# Altium schematic sheet DRS_POWER_GRAPH.SchDoc: My title
size A3; Organization: University of California; Address1: 475 Portola Plaza; Address2: Los Angeles, CA 90095; DocumentNumber: 3; Revision: R01; SheetNumber: 3; SheetTotal: 35
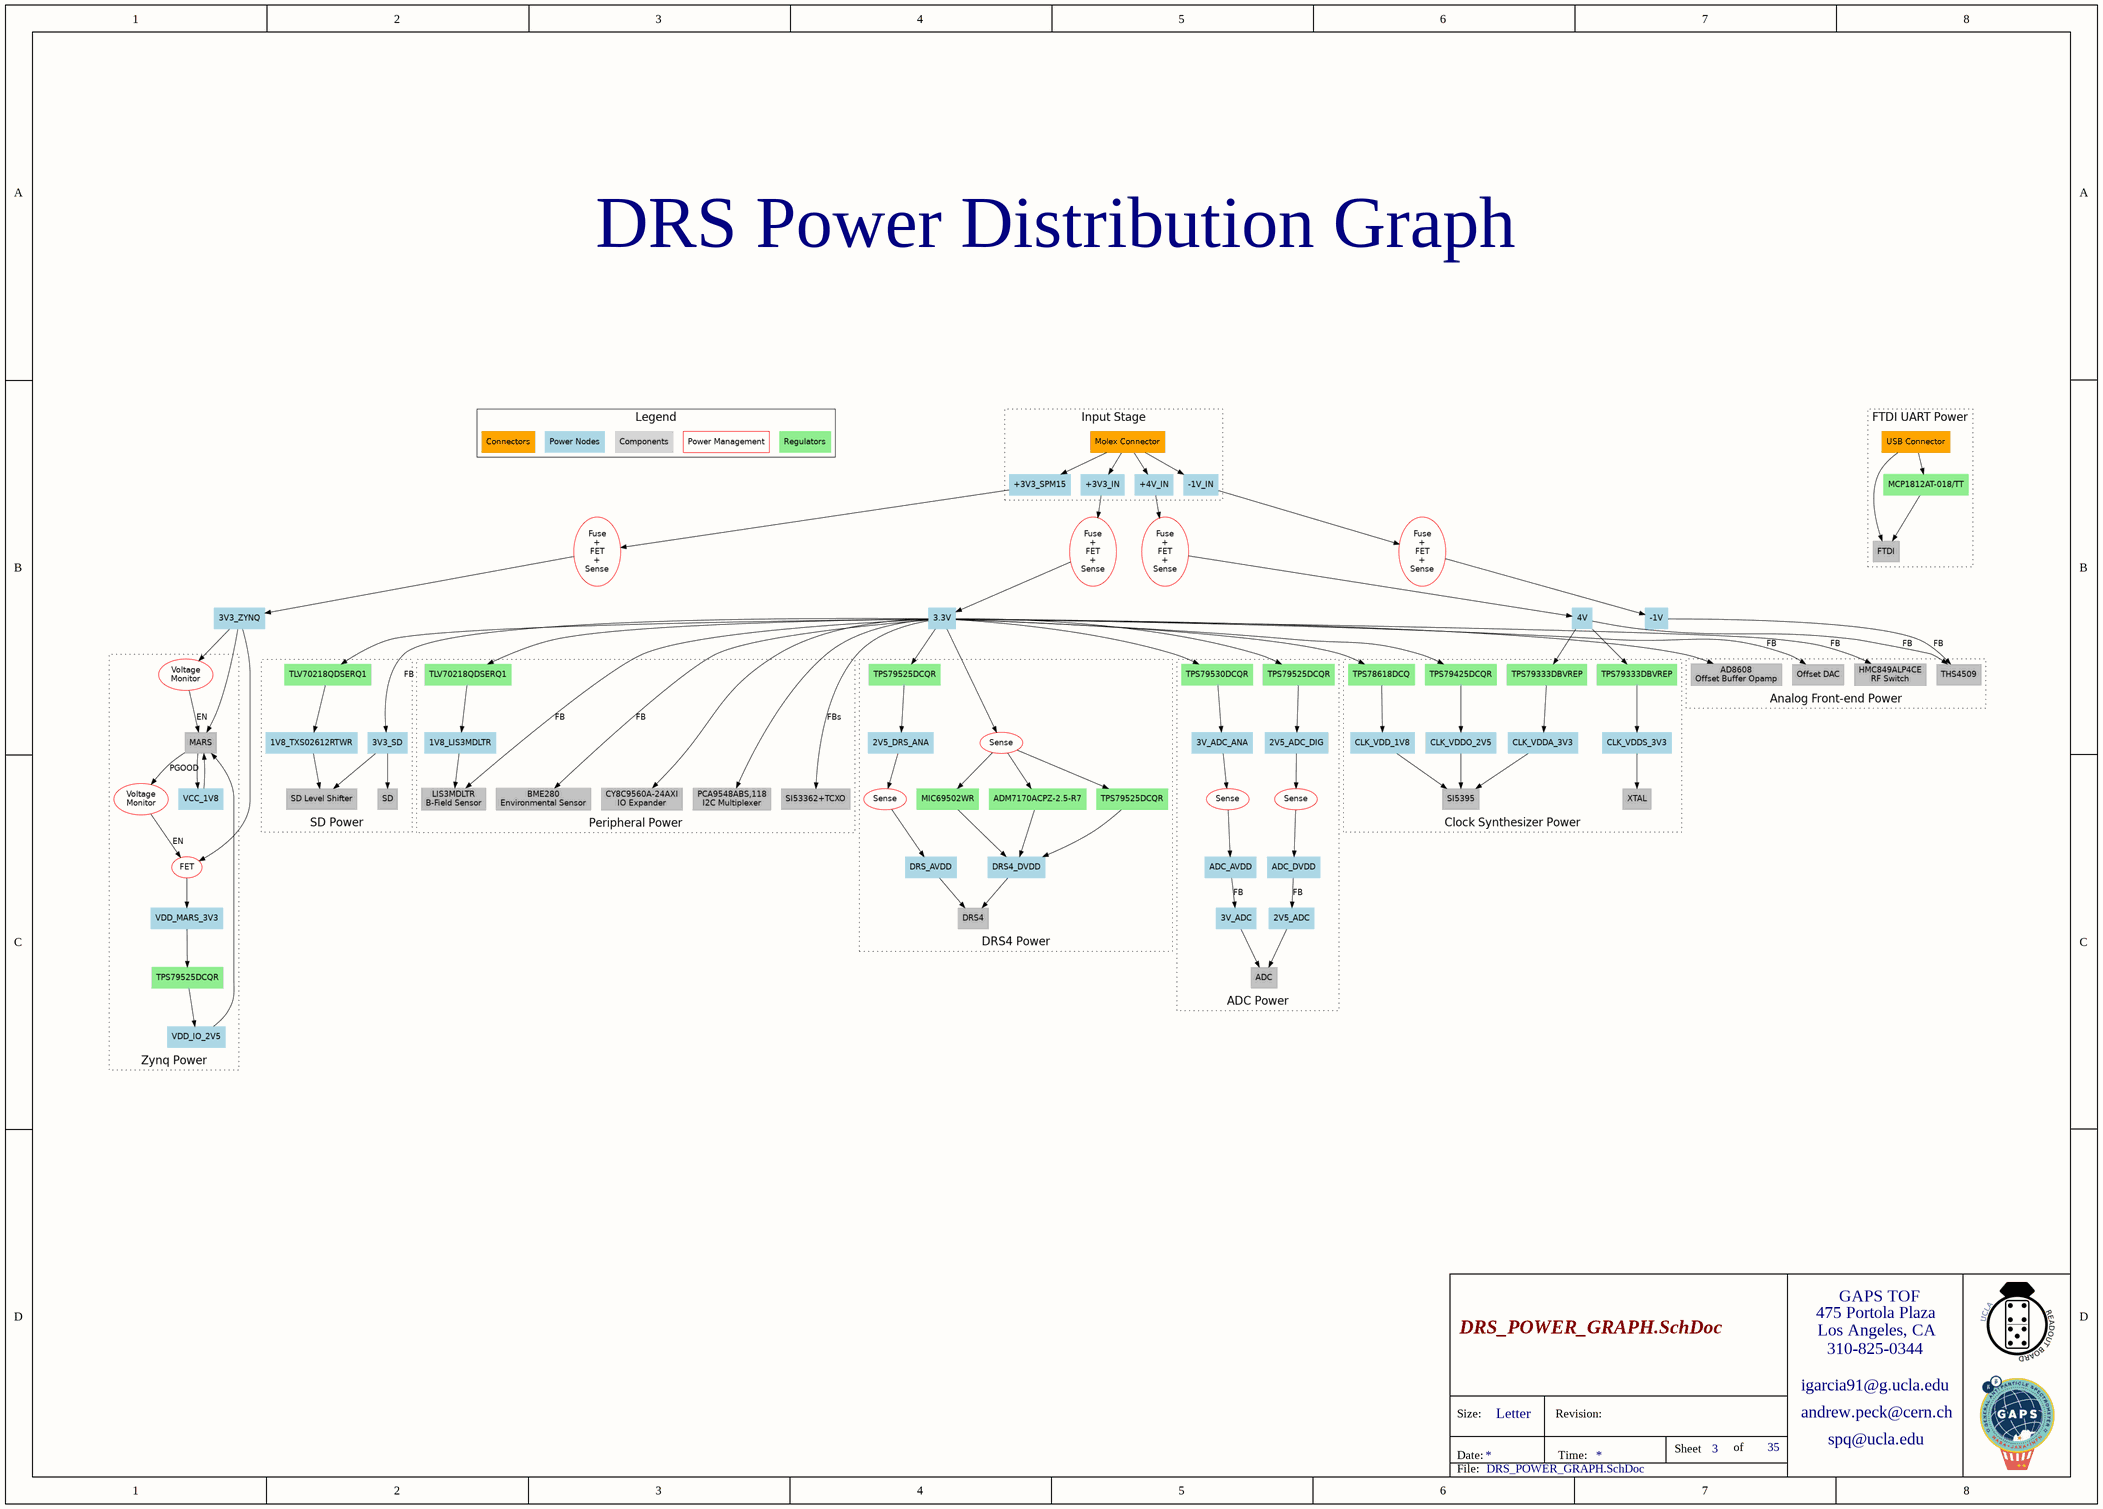
[diagram p0: DRS_POWER_GRAPH.SchDoc]

## Notes on the sheet
- DRS Power Distribution Graph
- 475 Portola Plaza
- GAPS TOF
- igarcia91@g.ucla.edu
- Los Angeles, CA
- 310-825-0344
- Size:
- Date:
- Letter
- Revision:
- Time:
- Sheet
- of
- andrew.peck@cern.ch
- spq@ucla.edu
- File: